# EAGLE design Timelapse_camera_RevC (EAGLE 7.6.0)
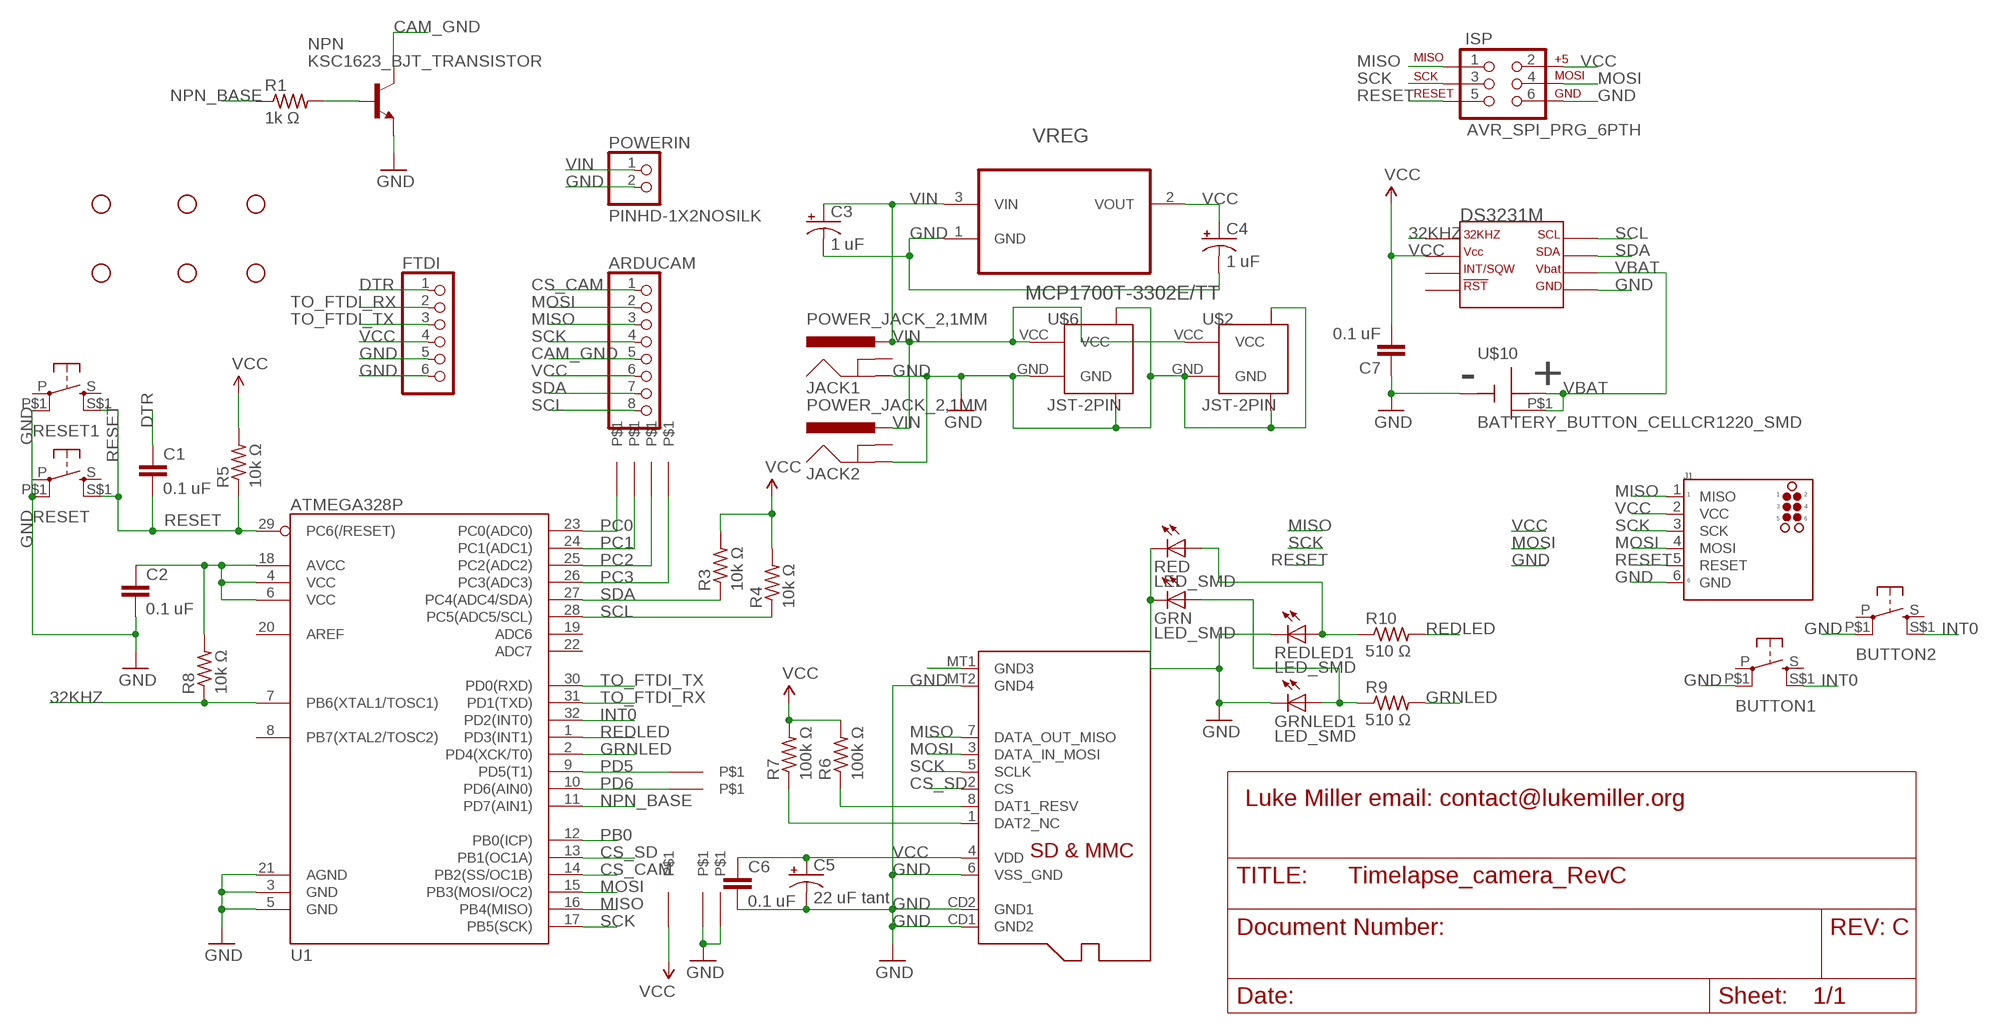
[diagram p0: schematic, sheet 1]

## Parts
ARDUCAM  PINHD-1X8RIGHTANGLE_FEMALE  [1X08-RA]
BUTTON1  PUSHBUTTON_DPST_SMDSTANDARD  [PUSHBUTTON_DPST_SMD]
BUTTON2  PUSHBUTTON_DPST_SMDSTANDARD  [PUSHBUTTON_DPST_SMD]
C1  0.1 uF  CAP0805  [0805]
C2  0.1 uF  CAP0805  [0805]
C3  1 uF  CPOL-USB  [PANASONIC_B]
C4  1 uF  CPOL-USB  [PANASONIC_B]
C5  22 uF tant  CPOL-US0805  [C0805_POL]
C6  0.1 uF  CAP0805  [0805]
C7  0.1 uF  CAP0805  [0805]
DS3231M  DS3231MSOIC-8  [DS3231M_SOIC8]
FTDI  PINHD-1X6CB  [1X06-CLEANBIG]
GRN  LED_SMD  [CHIPLED_0805]
GRNLED1  LED_SMD  [CHIPLED_0805]
ISP  AVR_SPI_PRG_6PTH  [2X3]
J1  TC2030-MCP-NL  [TC2030-MCP-NL]
JACK1  POWER_JACK_2,1MM  [POWER_JACK_DC_2,1MM]
JACK2  POWER_JACK_2,1MM  [POWER_JACK_DC_2,1MM]
NPN  KSC1623_BJT_TRANSISTOR  [SOT23]
POWERIN  PINHD-1X2NOSILK  [1X02_NOSILK]
R1  1k Ω  RESISTOR_SMDR0805  [R0805]
R3  10k Ω  RESISTOR_SMDR0805  [R0805]
R4  10k Ω  RESISTOR_SMDR0805  [R0805]
R5  10k Ω  RESISTOR_SMDR0805  [R0805]
R6  100k Ω  RESISTOR_SMDR0805  [R0805]
R7  100k Ω  RESISTOR_SMDR0805  [R0805]
R8  10k Ω  RESISTOR_SMDR0805  [R0805]
R9  510 Ω  RESISTOR_SMDR0805  [R0805]
R10  510 Ω  RESISTOR_SMDR0805  [R0805]
RED  LED_SMD  [CHIPLED_0805]
REDLED1  LED_SMD  [CHIPLED_0805]
RESET  PUSHBUTTON_DPST_SMDSTANDARD  [PUSHBUTTON_DPST_SMD]
RESET1  PUSHBUTTON_DPST_SMDSTANDARD  [PUSHBUTTON_DPST_SMD]
STANDOFF1  STAND-OFF  [STAND-OFF]
STANDOFF2  STAND-OFF  [STAND-OFF]
STANDOFF3  STAND-OFF  [STAND-OFF]
STANDOFF4  STAND-OFF  [STAND-OFF]
STANDOFF5  STAND-OFF  [STAND-OFF]
STANDOFF6  STAND-OFF  [STAND-OFF]
U1  ATMEGA328P  ATMEGA328_SMT  [TQFP32-08]
U$1  PINHD-1X1STANDARD  [1X01]
U$2  JST-2PIN  [JST-2-SMD-VERT]
U$3  MICROSD  [MICROSD]
U$4  PINHD-1X1STANDARD  [1X01]
U$6  JST-2PIN  [JST-2-SMD-VERT]
U$7  PINHD-1X1STANDARD  [1X01]
U$8  PINHD-1X1STANDARD  [1X01]
U$9  PINHD-1X1STANDARD  [1X01]
U$10  BATTERY_BUTTON_CELLCR1220_SMD  [CR1220_BATTERY_HOLDER_SMD]
U$11  PINHD-1X1STANDARD  [1X01]
U$12  PINHD-1X1STANDARD  [1X01]
U$13  PINHD-1X1STANDARD  [1X01]
U$14  PINHD-1X1STANDARD  [1X01]
VREG  MCP1700T-3302E/TT  [SOT95P237X112-3N]

## Nets
32KHZ: DS3231M.1(P$1_32KHZ) R8.1 U1.7(PB6(XTAL1/TOSC1))
CAM_GND: ARDUCAM.5 NPN.3(C)
CD1: U$3.MT1(GND3)
CS_CAM: ARDUCAM.1 U1.14(PB2(SS/OC1B))
CS_SD: U1.13(PB1(OC1A)) U$3.2(CS)
DTR: C1.1 FTDI.1
GND: BUTTON1.P$1(P1) BUTTON2.P$1(P1) C2.2 C3.- C4.- C5.P$2_C(-) C6.2 C7.1 DS3231M.5(P$5_GND) FTDI.5 FTDI.6 GRN.C GRNLED1.C ISP.6 J1.6(GND) JACK1.P$2(GND) JACK2.P$2(GND) NPN.2(E) POWERIN.2 RED.C REDLED1.C RESET1.P$1(P1) RESET.P$1(P1) U1.3(GND) U1.5(GND) U1.21(AGND) U$2.GND U$2.P$1(BODY1) U$2.P$2(BODY2) U$3.6(VSS_GND) U$3.CD1(GND2) U$3.CD2(GND1) U$3.MT2(GND4) U$6.GND U$6.P$1(BODY1) U$6.P$2(BODY2) U$10.GND U$12.1 U$14.1 VREG.1(GND)
GRNLED: R9.2 U1.2(PD4(XCK/T0))
INT0: BUTTON1.S$1(S1) BUTTON2.S$1(S1) U1.32(PD2(INT0))
MISO: ARDUCAM.3 ISP.1 J1.1(MISO) U1.16(PB4(MISO)) U$3.7(DATA_OUT_MISO)
MOSI: ARDUCAM.2 ISP.4 J1.4(MOSI) U1.15(PB3(MOSI/OC2)) U$3.3(DATA_IN_MOSI)
N$1: NPN.1(B) R1.2
N$2: R7.1 U$3.1(DAT2_NC)
N$3: R6.1 U$3.8(DAT1_RESV)
N$8: GRN.A GRNLED1.A R9.1
N$9: R10.1 RED.A REDLED1.A
NPN_BASE: R1.1 U1.11(PD7(AIN1))
PB0: U1.12(PB0(ICP))
PC0: U1.23(PC0(ADC0)) U$1.1
PC1: U1.24(PC1(ADC1)) U$4.1
PC2: U1.25(PC2(ADC2)) U$7.1
PC3: U1.26(PC3(ADC3)) U$8.1
PD5: U1.9(PD5(T1)) U$9.1
PD6: U1.10(PD6(AIN0)) U$11.1
REDLED: R10.2 U1.1(PD3(INT1))
RESET: C1.2 ISP.5 J1.5(RESET) R5.1 RESET1.S$1(S1) RESET.S$1(S1) U1.29(PC6(/RESET))
SCK: ARDUCAM.4 ISP.3 J1.3(SCK) U1.17(PB5(SCK)) U$3.5(SCLK)
SCL: ARDUCAM.8 DS3231M.8(P$8_SCL) R4.1 U1.28(PC5(ADC5/SCL))
SDA: ARDUCAM.7 DS3231M.7(P$7_SDA) R3.1 U1.27(PC4(ADC4/SDA))
TO_FTDI_RX: FTDI.2 U1.31(PD1(TXD))
TO_FTDI_TX: FTDI.3 U1.30(PD0(RXD))
VBAT: DS3231M.6(P$6_VBAT) U$10.P$1(P$2_VBAT) U$10.P$2(VBAT)
VCC: ARDUCAM.6 C2.1 C4.+ C5.P$1_A(+) C6.1 C7.2 DS3231M.2(P$2_VCC) FTDI.4 ISP.2 J1.2(VCC) R3.2 R4.2 R5.2 R6.2 R7.2 R8.2 U1.4(VCC) U1.6(VCC) U1.18(AVCC) U$3.4(VDD) U$13.1 VREG.2(VOUT)
VIN: C3.+ JACK1.P$1(PWR) JACK2.P$1(PWR) POWERIN.1 U$2.VCC U$6.VCC VREG.3(VIN)
Unconnected: BUTTON1.P BUTTON1.S BUTTON2.P BUTTON2.S DS3231M.3(P$3_INT) DS3231M.4(P$4_RST) JACK1.P$3(GNDBREAK) JACK2.P$3(GNDBREAK) RESET1.P RESET1.S RESET.P RESET.S U1.8(PB7(XTAL2/TOSC2)) U1.19(ADC6) U1.20(AREF) U1.22(ADC7)

## Library data of the parts
ARDUCAM = miller:PINHD-1X8: PIN HEADER
BUTTON1 BUTTON2 RESET RESET1 = miller:PUSHBUTTON_DPST_SMD: PUSHBUTTON DPST SMD Omron B3S-1000 Digikey PN SW836CT-ND This is your standard "hobbyist" style momentary pushbutton in a surface mount package.
C1 C2 C6 C7 = miller:CAP: Capacitor Standard surface mount ceramic capacitor and 0.1" leaded capacitor.
C3-C5 = miller:CPOL-US: POLARIZED CAPACITOR, American symbol
DS3231M = miller:DS3231M: DS3231M real time clock Battery backup, 2.3V to 5.5V supply voltage 1Hz and 32.768kHz outputs NOTE: This is a slightly lower cost version of the regular DS3231S, with fewer clock frequency output options and slightly lower long-term time accuracy. It uses the same I2C communications protocol as the DS3231S, and is available in a small SOIC-8 package or Wide SOIC-16 (0.300") package. Maxim PN DS3231MZ+ SOIC-8 package Maxim PN DS3231M+ SOIC-16 Wide package
FTDI = miller:PINHD-1X6: PIN HEADER
GRN GRNLED1 RED REDLED1 = miller:LED_SMD: LED surface mount 0805
ISP = miller:AVR_SPI_PRG_6: AVR ISP 6 Pin This is the reduced ISP connector for AVR programming. Common on Arduino. This footprint will take up less PCB space and can be used with a 10-pin to 6-pin adapter such as SKU: BOB-08508 **Special note about "TEST_POINT" package. The stop mask is on the top side, so if you want your programming test points to be on the bottom of your board, make sure to place this package on the bottom side of the board. This also ensure that the orientation to program from the bottom side will be correct.
J1 = miller:TC2030: TAG-CONNECT ICSP Connector Manufacturer: Tag-Connect <http://www.tag-connect.com> Cable for easy In-Circuit Serial Programming. Designed for Microchip ICD2, suitable for many others. Two variants - one "with legs" (for hands-free fit on PCB) and another "without legs" for quick programming. Pin labels changed to match AVR ICSP pinout for programming ATMEL AVR chips PAD Description 1 MCLR/Vpp 2 Vdd 3 GND 4 PGD (ISPDAT) 5 PGC (ISPCLK) 6 nc (used for LVP) ©2009 ROFA.cz - modified and updated by Robert Darlington ‹rdarlington@gmail.com›
JACK1 JACK2 = miller:POWER_JACK_2,1MM: DC Power Jack, 2.1mm center pin. Digikey PN CP-202AH-ND
NPN = miller:KSC1623_BJT_TRANSISTOR: KSC1623 BJT NPN transistor - Fairchild Seminconductor KSC1623LMTF Digikey PN KSC1623LMTFCT-ND Mouser PN 512-KSC1623LMTF
POWERIN = miller:PINHD-1X2: 1x2 pin header 0.1" spacing (2.54mm)
R1 R3-R10 = miller:RESISTOR_SMD: RESISTOR, American symbol
STANDOFF1-STANDOFF6 = miller:STAND-OFF: #4 Stand Off This is the mechanical footprint for a #4 phillips button head screw. Use the keepout ring to avoid running the screw head into surrounding components. SKU : PRT-00447
U1 = miller:ATMEGA328_SMT: 32-Pin Atmega328
U$1 U$4 U$7-U$9 U$11-U$14 = miller:PINHD-1X1: Just a single pin header, useful for making test point or stand-alone header hole for normal 0.1" pitch through-hole header pins The SMALL footprint is 0.035" diameter, barely large enough for standard 0.1" pitch header pins. The SMALL_0.7 footprint is 1.056mm diameter, drill hole is 0.7mm, too small for 0.1" pitch header pins
U$2 U$6 = miller:JST-2PIN: JST B2B-PH-SM4-TM 2-pin connector 2.0 mm spacing surface mount, vertical entry Accepts JST PHR-2 female connectors
U$3 = miller:MICROSD: Micro-SD / Transflash card holder with SPI pinout For the 3M # 2908-05WB-MG and/or 4UCON #19656 push-push type (spring-loaded) Digikey PN 3M5607CT-ND
U$10 = miller:BATTERY_BUTTON_CELL: Coin cell battery holders Check that you choose the appropriate battery size CR1025 (10 mm) CR1220 (12 mm)
VREG = Microchip_By_element14_Batch_1:MCP1700T-3302E/TT: Low Quiescent Current LDO; MPN: MCP1700T-3302E/TT; OC_FARNELL: 1296592; OC_NEWARK: 88H9817; PACKAGE: SOT23-3; SUPPLIER: Microchip

## Board
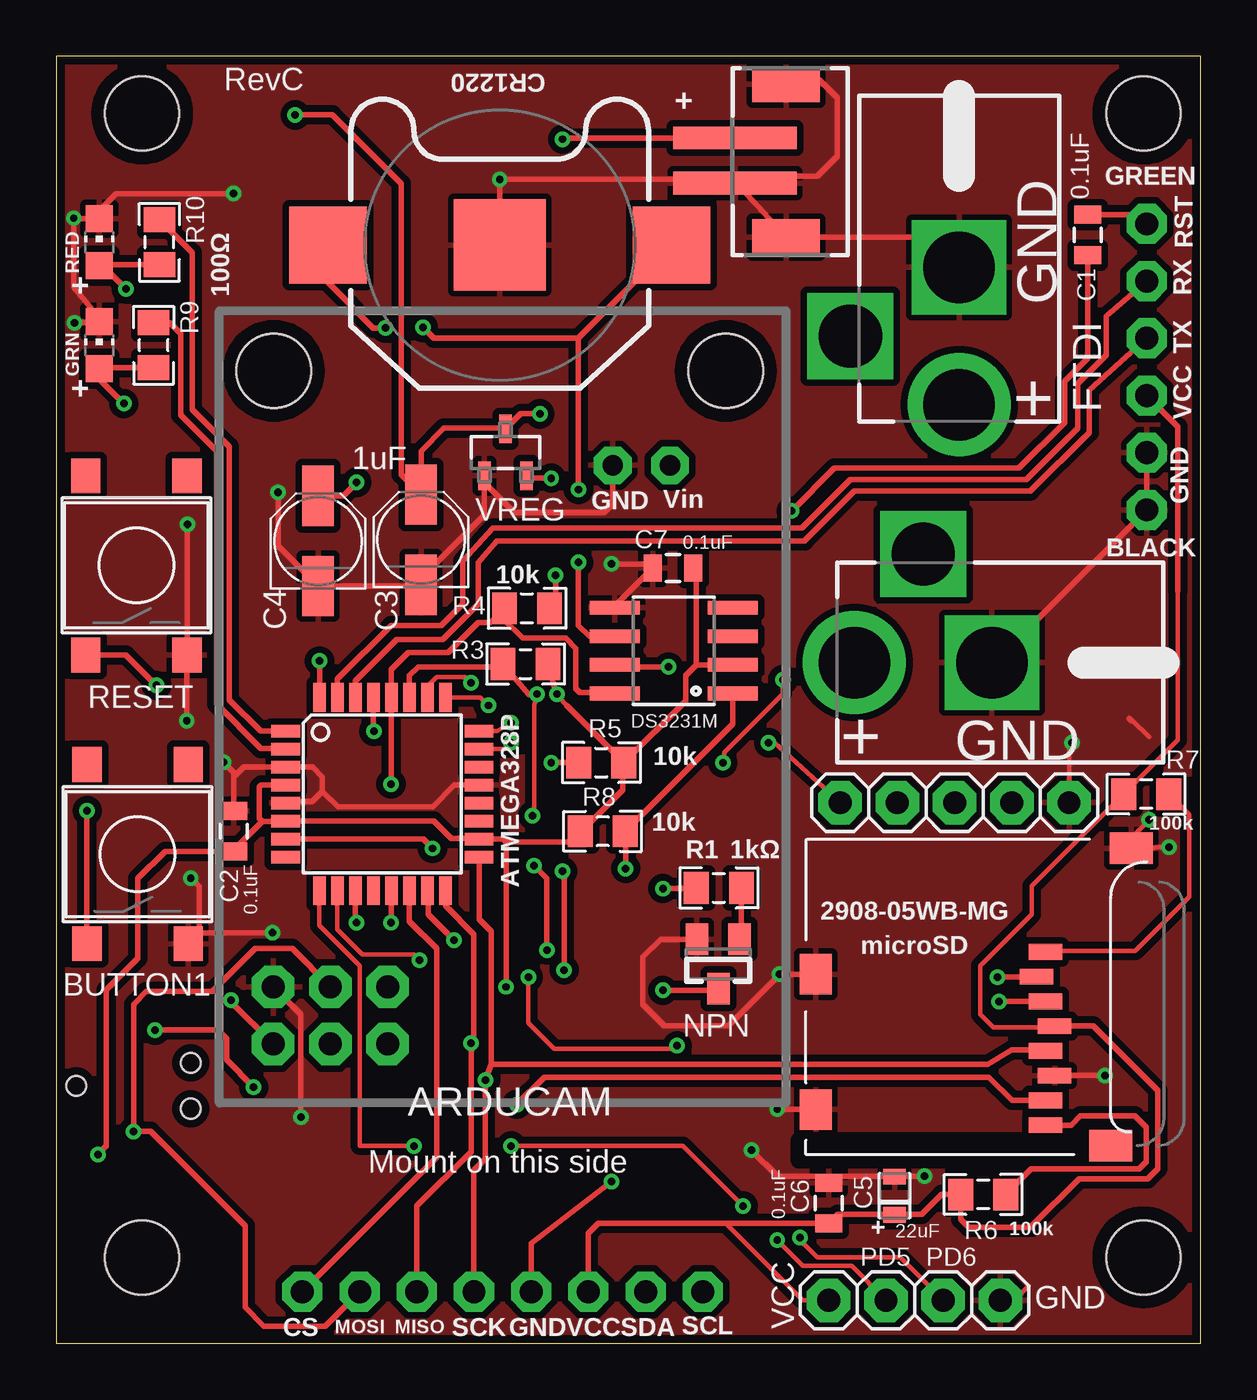
[diagram p1: board, top side]
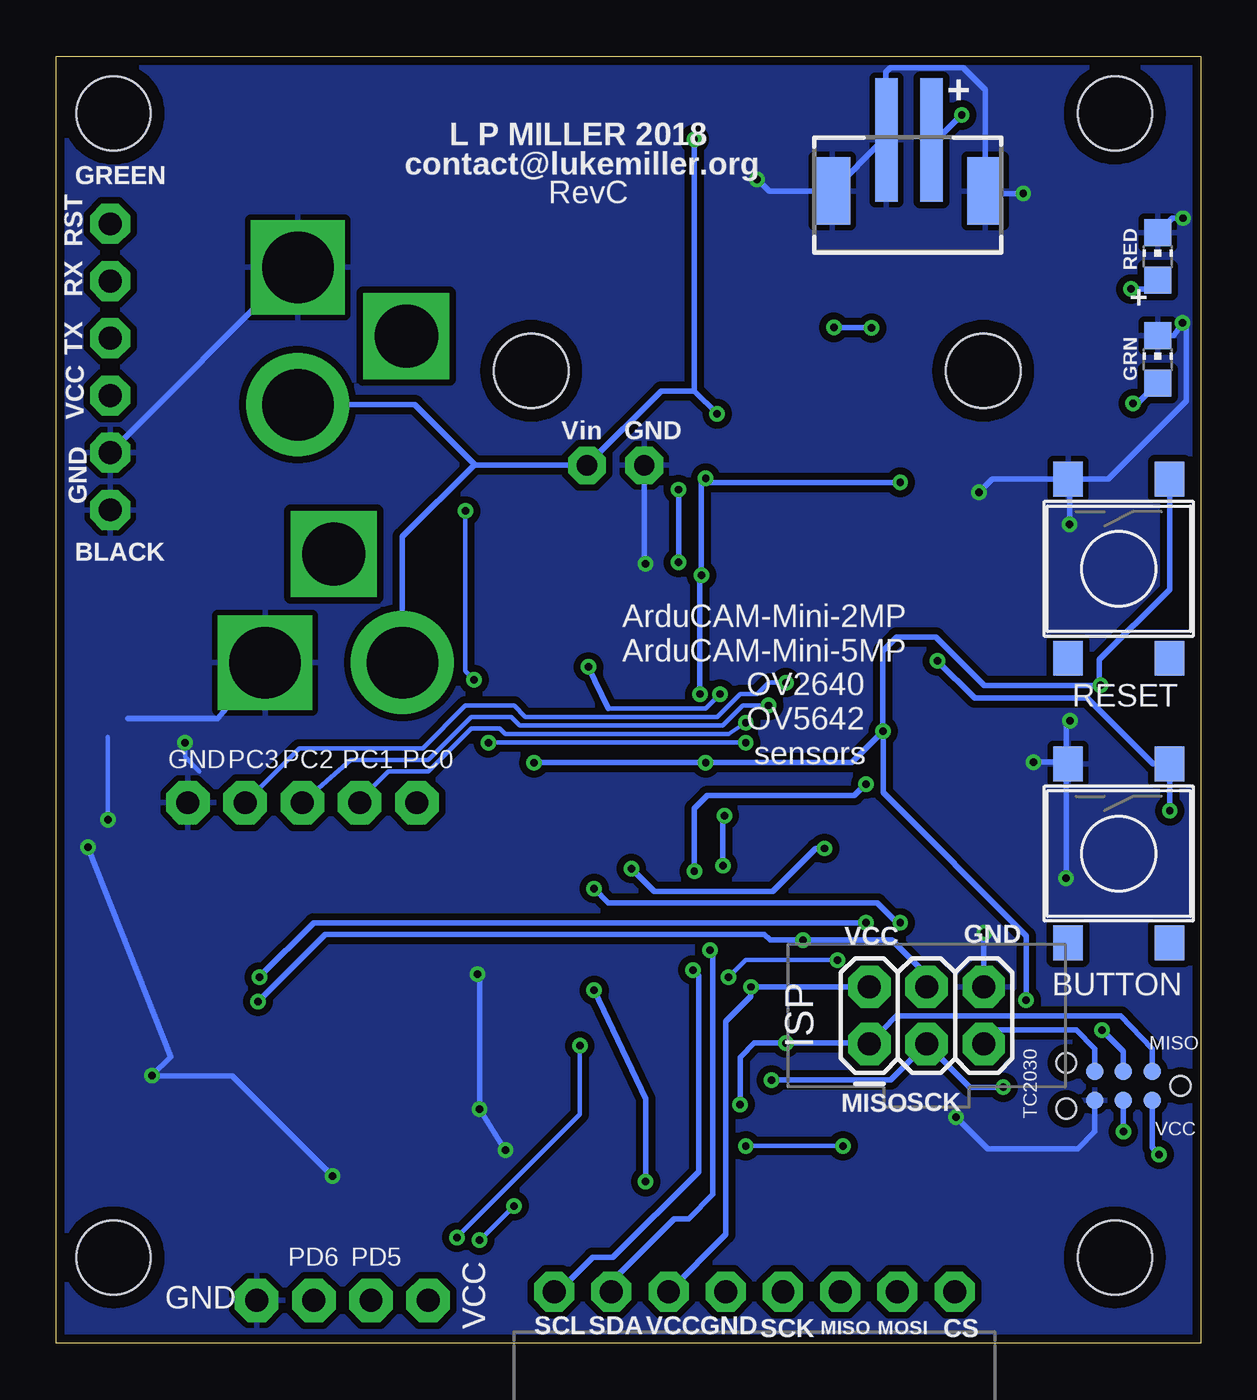
[diagram p2: board, bottom side, seen from below]

Size 50.8 x 57.15 mm. Coordinates in mm from the lower left corner, seen from the top.
Outline: 0,0 50.8,0 50.8,57.15 0,57.15 0,0
Copper layers (1*16): Top 0.0356mm / dielectric 1.5011mm / Bottom 0.0356mm
Design rules "LaenPCBOrder *": minimum track width 6mil, minimum drill 13mil, track to track 6mil, track to pad 6mil, pad to pad 6mil, via to via 6mil, smd to smd 6mil, copper to edge 15mil, drill to drill 6mil, minimum pad ring 7mil, minimum via ring 7mil, stop-mask expansion 3mil, vias tented up to drill 30mil, thermal gap 10mil

### Footprints (pad centres in the part's own frame; a part is rotated, then mirrored left to right if it is on the bottom)
1X08-RA = drill 1.016 pad 1.778 octagon: 1 0,0; 2 2.54,0; 3 5.08,0; 4 7.62,0; 5 10.16,0; 6 12.7,0; 7 15.24,0; 8 17.78,0
PUSHBUTTON_DPST_SMD = smd 1.55 x 1.3: P 3.975,-2.25; P$1 -3.975,-2.25; S 3.975,2.25; S$1 -3.975,2.25
0805 = smd 0.8 x 1.2: 1 -0.9,0; 2 0.9,0
PANASONIC_B = smd 2.667 x 1.4: + 2.006,0; - -2.006,0
C0805_POL = smd 0.7 x 1: P$1_A -0.85,0; P$2_C 0.85,0
DS3231M_SOIC8 = smd 0.61 x 2.21: 1 -1.905,-2.616; 2 -0.635,-2.616; 3 0.635,-2.616; 4 1.905,-2.616; 5 1.905,2.616; 6 0.635,2.616; 7 -0.635,2.616; 8 -1.905,2.616
1X06-CLEANBIG = drill 1.016 pad 1.778 octagon: 1 -6.35,0; 2 -3.81,0; 3 -1.27,0; 4 1.27,0; 5 3.81,0; 6 6.35,0
CHIPLED_0805 = smd 1.2 x 1.2: A 0,-1.05; C 0,1.05
2X3 = drill 1.016 pad 1.88 octagon: 1 -2.54,0; 2 -2.54,2.54; 3 0,0; 4 0,2.54; 5 2.54,0; 6 2.54,2.54
TC2030-MCP-NL = smd 0.787 x 0.787: 1 1.27,-0.635; 2 1.27,0.635; 3 2.54,-0.635; 4 2.54,0.635; 5 3.81,-0.635; 6 3.81,0.635 | hole 0.889: 0,0; 5.08,-1.016; 5.08,1.016
POWER_JACK_DC_2,1MM = drill 3.175 pad 4.572: P$1 0,0 | drill 3.175 square: P$2 6.096,0 | drill 2.8 square: P$3 3.048,4.826
SOT23 = smd 1 x 1.4: 1 -0.95,-1.1; 2 0.95,-1.1; 3 0,1.1
1X02_NOSILK = drill 0.9 pad 1.676 octagon: 1 -1.27,0; 2 1.27,0
R0805 = smd 1.1 x 1.4: 1 -1,0; 2 1,0
STAND-OFF = hole 3.302: 0,0
TQFP32-08 = smd 1.27 x 0.559: 1 -4.293,2.8; 2 -4.293,2; 3 -4.293,1.2; 4 -4.293,0.4; 5 -4.293,-0.4; 6 -4.293,-1.2; 7 -4.293,-2; 8 -4.293,-2.8; 17 4.293,-2.8; 18 4.293,-2; 19 4.293,-1.2; 20 4.293,-0.4; 21 4.293,0.4; 22 4.293,1.2; 23 4.293,2; 24 4.293,2.8 | smd 0.559 x 1.27: 9 -2.8,-4.293; 10 -2,-4.293; 11 -1.2,-4.293; 12 -0.4,-4.293; 13 0.4,-4.293; 14 1.2,-4.293; 15 2,-4.293; 16 2.8,-4.293; 25 2.8,4.293; 26 2,4.293; 27 1.2,4.293; 28 0.4,4.293; 29 -0.4,4.293; 30 -1.2,4.293; 31 -2,4.293; 32 -2.8,4.293
1X01 = drill 1.016 pad 1.93 octagon: 1 0,0
JST-2-SMD-VERT = smd 1 x 5.5: GND 1,-2; VCC -1,-2 | smd 1.6 x 3: P$1 -3.4,0.27; P$2 3.4,0.27
MICROSD = smd 0.7 x 1.5: 1 9,-10.64; 2 7.9,-10.24; 3 6.8,-10.64; 4 5.7,-11.04; 5 4.6,-10.64; 6 3.5,-11.04; 7 2.4,-10.64; 8 1.3,-10.64 | smd 1.8 x 1.4: CD1 2,-0.44; CD2 8,-0.44 | smd 1.4 x 1.9: MT1 0.4,-13.54; MT2 13.6,-14.44
CR1220_BATTERY_HOLDER_SMD = smd 4.064 x 4.064: GND 0,0 | smd 3.429 x 3.429: P$1 -7.62,0; P$2 7.62,0
SOT95P237X112-3N = smd 0.559 x 1.27: 1 -0.94,-1.041; 2 0.94,-1.041; 3 0,1.041

### Placement (x,y rotation side)
ARDUCAM  10.92,2.29 180 bottom
BUTTON1  3.61,21.72 90 top
BUTTON2  3.63,21.74 270 bottom
C1  45.78,49.21 270 top
C2  7.87,22.73 90 top
C3  16.19,35.69 90 top
C4  11.62,35.62 90 top
C5  37.21,6.55 90 top
C6  34.29,6.22 90 top
C7  27.37,34.42 0 top
DS3231M  27.41,30.76 90 top
FTDI  48.41,43.36 270 top
GRN  1.91,44.32 0 top
GRNLED1  1.91,43.69 0 bottom
ISP  12.17,13.28 0 bottom
J1  0.89,11.43 180 bottom
JACK1  40.08,41.68 90 top
JACK2  35.43,30.23 0 top
NPN  29.39,16.84 180 top
POWERIN  25.97,38.99 180 top
R1  29.41,20.22 0 top
R3  20.83,30.16 0 top
R4  20.89,32.64 0 top
R5  24.19,25.78 0 top
R6  41.15,6.6 180 top
R7  48.39,24.38 180 top
R8  24.26,22.73 180 top
R9  4.32,44.32 90 top
R10  4.57,48.9 90 top
RED  1.91,48.9 0 top
REDLED1  1.91,48.26 0 bottom
RESET  3.56,34.54 90 top
RESET1  3.63,34.39 270 bottom
STANDOFF1  48.26,3.81 0 top
STANDOFF2  48.26,54.61 0 top
STANDOFF3  3.81,3.81 0 top
STANDOFF4  3.81,54.61 0 top
STANDOFF5  9.65,43.18 0 top
STANDOFF6  29.72,43.18 0 top
U1  14.48,24.38 0 top
U$1  34.8,24 0 top
U$2  12.95,51.44 180 bottom
U$3  33.27,8.38 90 top
U$4  37.34,24 0 top
U$6  32.13,52.51 270 top
U$7  39.88,24 0 top
U$8  42.42,24 0 top
U$9  36.83,1.91 0 top
U$10  19.68,48.77 0 top
U$11  39.37,1.91 0 top
U$12  41.91,1.91 0 top
U$13  34.29,1.91 0 top
U$14  44.96,24 0 top
VREG  19.94,39.56 0 top

### Tracks (layer width: path | path; a pad name or v marks a point on that pad's centre or on a via)
32KHZ  (via drill 0.33)
  Top 0.254: DS3231M.1 30.02,27.5 R8.1 25.27,22.72 v25.27,21.08 | U1.7 16.29,22.38 v16.7,21.97
  Bottom 0.254: v16.7,21.97 17.08,21.97 18.99,20.07 24.26,20.07 v25.27,21.08
CAM_GND  (via drill 0.33)
  Top 0.254: ARDUCAM.5 21.08,4.45 v24.64,7.18 | v26.92,15.67 29.32,15.67 NPN.3
  Bottom 0.254: v24.64,7.18 24.64,10.85 v26.92,15.67
CS_CAM
  Top 0.254: U1.14 15.68,18.74 16.89,17.53 16.89,8.26 ARDUCAM.1
CS_SD  (via drill 0.33)
  Top 0.254: U1.13 14.88,18.69 v14.86,18.67 | v41.78,16.26 43.49,16.26 U$3.2
  Bottom 0.254: v14.86,18.67 39.37,18.67 v41.78,16.26
DTR
  Top 0.254: C1.1 48.01,50.11 FTDI.1
GND  (via drill 0.33)
  Top 0.203: U$3.MT2 47.71,22.44 v48.51,23.24 | 48.51,26.92 47.75,27.69 | U$12.1 42.55,1.91 43.18,2.54 | U$14.1 44.96,26.54 v45.09,26.67
  Top 0.254: v9.59,18.22 6.34,18.22 | 6.34,18.22 BUTTON1.P$1 | v46.56,11.89 U$3.6 | 34.57,7.4 C5.P$2_C 38.52,7.4 v38.54,7.43 | 34.57,7.4 C6.2 | U$3.CD1 32.01,10.38 v32,10.39 | U$3.CD2 v32.11,16.38 29.82,14.1 26.99,14.1 26.04,15.05 26.04,17.14 26.83,17.94 NPN.2 | 34.57,7.4 32.03,7.4 v30.86,8.57 | DS3231M.5 24.79,32.74 C7.1 26.28,34.61 v24.64,34.61 | 11.81,24.51 11.81,25.15 11.37,25.58 U1.3 8.32,25.59 7.87,25.15 | 11.81,24.51 11.37,24.07 10.27,24.07 U1.5 | FTDI.5 FTDI.6 41.53,30.12 JACK2.P$2 | 47.71,27.66 47.62,27.75 | U$3.MT2 47.55,21.98 v49.4,22.04 | v10.86,10.03 10.86,14.59 ISP.6 | U1.21 17.67,24.78 16.7,23.81 12.51,23.81 11.81,24.51 | C2.2 7.87,25.15 | 7.87,25.15 7.87,25.35 v7.42,25.81 | 6.34,18.22 6.34,20.28 v5.97,20.65 | v0.8,45.31 1.85,45.31 GRN.C 1.91,45.52 0.78,46.9 v0.78,49.96 0.98,49.95 RED.C 1.91,50.29 2.67,51.05 v7.87,51.05 | U$10.GND v19.68,51.69 30.11,51.69 U$6.GND | v9.84,37.78 9.84,35.4 C4.- 16.13,33.62 C3.- 16.19,33.97 18.99,36.77 18.99,38.51 VREG.1 19,38.21 20.32,36.89 24.32,36.89 24.7,37.27 POWERIN.2 | v5.79,27.64 5.79,30.55 RESET.P$1 5.81,36.36 v5.82,36.37 | U$6.P$1 33.87,56.1 34.67,55.31 34.67,52.7 33.78,51.82 30.24,51.82 U$6.GND | U$6.GND 30.13,51.58 U$6.P$2 38.94,49.11 JACK1.P$2
  Bottom 0.203: v45.09,26.67 45.09,26.04 44.45,25.4 | v48.51,23.24 48.51,26.92
  Bottom 0.254: ISP.6 9.63,18.19 v9.59,18.22 | v32.11,16.38 32,16.28 v32,10.39 v30.86,8.57 | 47.62,27.75 43.62,27.75 JACK2.P$2 | v49.4,22.04 45.72,12.72 v46.56,11.89 46.55,11.87 42.99,11.87 v38.54,7.43 | J1.6 4.7,9.4 5.46,8.64 9.46,8.64 v10.86,10.03 | v7.42,25.81 5.97,25.81 | 5.97,25.81 BUTTON2.P$1 5.97,25.63 v5.97,20.65 | GRNLED1.C 1.19,44.74 v0.8,45.31 0.64,45.29 0.64,41.83 4.1,38.37 RESET1.P$1 | v0.78,49.96 1.25,49.96 REDLED1.C | v7.87,51.05 9.44,51.05 U$2.P$1 9.55,55.66 10.54,56.64 13.78,56.64 13.97,56.45 13.97,53.45 U$2.GND 14.08,53.44 U$2.P$2 19.16,51.16 v19.68,51.69 | RESET1.P$1 9.26,38.37 v9.84,37.78 | 5.97,25.81 5.97,27.45 v5.79,27.64 | v5.82,36.37 5.82,38.3 RESET1.P$1 | JACK1.P$2 40.18,47.78 FTDI.5 | POWERIN.2 24.7,34.67 v24.64,34.61
  pour Top (isolate 0.305): 0,-0.05 50.8,-0.05 50.8,57.15 0,57.15
  pour Bottom (isolate 0.305): 0,0 50.8,0 50.8,57.15 0,57.15
GRNLED
  Top 0.254: R9.2 5.03,45.32 5.52,44.83 5.52,41.21 7.11,39.62 7.11,28.38 9.08,26.42 10.15,26.42 U1.2
INT0  (via drill 0.33)
  Top 0.254: BUTTON1.S$1 1.36,23.63 v1.37,23.65 | v11.68,30.3 U1.32
  Bottom 0.254: v1.37,23.65 1.37,25.71 BUTTON2.S$1 2.1,25.72 5.03,28.65 10.03,28.65 v11.68,30.3
MISO  (via drill 0.33)
  Top 0.254: U1.16 17.28,19.43 18.54,18.16 18.54,13.46 v18.41,13.34 18.41,8.51 16,6.1 ARDUCAM.3 | U$3.7 42.43,10.78 41.4,11.81 21.65,11.81 v20.45,10.6
  Bottom 0.254: J1.1 2.16,13.08 3.56,14.54 13.51,14.54 ISP.1 14.76,13.34 v18.41,13.34 19.81,13.34 20.45,12.7 v20.45,10.6
MOSI  (via drill 0.33)
  Top 0.254: v17.65,17.91 16.51,19.05 16.51,20.06 U1.15 | ISP.4 10.46,17.53 8.83,17.53 6.92,15.62 4,15.62 3.43,15.05 v3.43,9.4 4.19,9.4 8.38,5.21 8.38,1.59 9.21,0.76 11.94,0.76 ARDUCAM.2 | v41.85,15.18 U$3.3
  Bottom 0.254: ISP.4 12.17,16.36 13.72,17.91 v17.65,17.91 19.11,17.91 19.37,18.16 38.86,18.16 v41.85,15.18 | J1.4 v3.43,9.4
N$1
  Top 0.254: R1.2 30.41,18.02 NPN.1
N$2
  Top 0.203: 43.88,17.42 47.9,17.42 50.29,19.81 50.29,23.48 R7.1
  Top 0.254: 43.88,17.42 U$3.1
N$3
  Top 0.254: U$3.8 45.05,9.68 45.47,10.1 47.88,10.1 48.39,9.59 48.39,8.06 48.07,7.75 43.29,7.75 R6.1
N$8  (via drill 0.33)
  Top 0.254: R9.1 1.96,43.32 GRN.A 1.91,42.82 v3,41.73
  Bottom 0.254: v3,41.73 2.81,41.73 GRNLED1.A
N$9  (via drill 0.33)
  Top 0.254: R10.1 1.96,47.9 RED.A 2.07,47.84 v3.1,46.81
  Bottom 0.254: v3.1,46.81 2.3,46.81 REDLED1.A
NPN_BASE  (via drill 0.33)
  Top 0.254: U1.11 13.28,18.73 v13.34,18.67 | v26.92,20.19 28.39,20.19 R1.1
  Bottom 0.254: v13.34,18.67 13.46,18.67 14.35,19.56 26.29,19.56 v26.92,20.19
PC0  (via drill 0.33)
  Top 0.203: U1.23 19.91,26.38 v20.19,26.67 | v31.62,26.67 31.88,26.67 U$1.1
  Bottom 0.203: v20.19,26.67 v31.62,26.67
PC1  (via drill 0.33)
  Top 0.203: U1.24 19.56,27.18 v20.19,27.56
  Bottom 0.203: v20.19,27.56 20.95,27.05 30.86,27.05 31.11,27.3 32.38,27.3 34.29,25.4 36.07,25.4 37.34,24.13 U$4.1
PC2  (via drill 0.33)
  Top 0.203: U1.25 18.82,28.68 v19.18,28.32
  Bottom 0.203: v19.18,28.32 20.32,28.32 21.21,27.43 30.23,27.43 30.61,27.81 32.38,27.81 34.29,25.91 37.72,25.91 U$7.1
PC3  (via drill 0.33)
  Top 0.203: U1.26 16.48,29.18 16.89,29.59 18.16,29.59 v18.41,29.34
  Bottom 0.203: v18.41,29.34 19.18,29.34 19.68,28.83 20.45,28.83 21.46,27.81 29.97,27.81 30.48,28.32 32.64,28.32 34.54,26.42 40.01,26.42 U$8.1
PD5  (via drill 0.33)
  Top 0.203: U1.9 11.68,18.55 13.46,16.76 13.46,8.76 v15.88,8.76 | v20.19,8.76 27.81,8.76 v30.48,6.1 | v32,4.57 33.15,3.43 35.31,3.43 U$9.1
  Bottom 0.203: v15.88,8.76 v20.19,8.76 | v30.48,6.1 v32,4.57
PD6  (via drill 0.33)
  Top 0.203: U1.10 12.48,18.38 13.59,17.27 15.88,17.27 v16.13,17.02 | v20.95,16.26 20.95,14.22 22.1,13.08 27.43,13.08 v27.56,13.21 | U$11.1 37.47,3.81 33.78,3.81 33.02,4.57 v33.02,4.7
  Bottom 0.203: v16.13,17.02 20.19,17.02 v20.95,16.26 | v27.56,13.21 27.56,10.16 v33.02,4.7
REDLED
  Top 0.254: U1.1 9.07,27.18 7.68,28.57 7.68,39.81 6.03,41.47 6.03,48.43 R10.2
RESET  (via drill 0.33)
  Top 0.203: v29.59,25.78 29.59,25.97 29.65,25.97 29.65,26.23 32.26,28.83 v32.26,29.46
  Top 0.254: U1.29 14.08,27.2 v14.1,27.18 | v7.75,15.24 7.75,15.16 ISP.5 | R5.1 v21.97,25.78 | C1.2 45.78,43.75 44.77,42.74 44.77,40.89 42.74,38.86 34.54,38.86 v32.64,36.96 | RESET.S$1 3.09,30.57 v4.45,29.21
  Bottom 0.203: 29.4,25.78 v29.59,25.78 | v32.64,36.96 32.64,29.84 v32.26,29.46
  Bottom 0.254: J1.5 4.7,13.08 5.52,13.91 9,13.91 ISP.5 | v14.1,27.18 14.1,24.45 7.75,18.1 v7.75,15.24 | v14.1,27.18 15.49,25.78 v21.97,25.78 29.4,25.78 | v14.1,27.18 14.12,27.2 14.12,30.73 13.49,31.37 11.76,31.37 9.6,29.21 v4.45,29.21 4.5,29.26 4.5,30.35 1.38,33.47 RESET1.S$1
SCK  (via drill 0.33)
  Top 0.254: U1.17 18.77,18.82 19.3,18.29 19.3,12.38 | 19.3,12.38 v19.05,11.68 19.05,8.19 18.54,7.68 ARDUCAM.4 | v4.38,13.91 7.18,13.91 7.56,13.53 7.56,12.57 v8.76,11.37 | 19.3,12.38 41.34,12.38 42.42,13.02 43.95,13.02 | 44.51,13.02 43.95,13.02 | 43.95,13.02 U$3.5
  Bottom 0.254: v19.05,11.68 13.77,11.68 ISP.3 10.25,11.37 v8.76,11.37 | J1.3 3.43,12.95 v4.38,13.91
SCL  (via drill 0.33)
  Top 0.254: DS3231M.8 24.75,28.89 23.24,28.89 23.05,29.08 23.05,30.86 22.61,31.3 20.7,31.3 19.89,32.12 R4.1 19.26,32 18.73,32 17.4,30.67 15.62,30.67 14.88,29.93 U1.28 14.86,28.66 v14.86,24.83 | v22.54,16.57 22.54,20.89 v22.48,20.95
  Bottom 0.254: ARDUCAM.8 28.51,2.29 26.99,3.81 26.1,3.81 22.29,7.62 22.29,16.32 v22.54,16.57 | v22.48,20.95 22.48,23.75 21.91,24.32 15.37,24.32 v14.86,24.83
SDA  (via drill 0.33)
  Top 0.203: v21.14,23.43 21.21,23.5 21.21,28.32 v21.34,28.83
  Top 0.254: U1.27 15.68,29.65 16.07,30.04 19.57,30.04 R3.1 20.97,28.81 v21.34,28.83 | v27.18,30.04 24.88,30.04 DS3231M.7 | v21.78,17.46 21.78,20.64 v21.21,21.21
  Bottom 0.203: 26.29,28.19 21.97,28.19 v21.34,28.83
  Bottom 0.254: 26.29,28.19 v27.18,30.04 | ARDUCAM.7 26.16,2.73 23.37,5.52 22.73,5.52 21.65,6.6 21.65,17.34 v21.78,17.46 | v21.21,21.21 21.21,23.37 v21.14,23.43
TO_FTDI_RX
  Top 0.254: U1.31 12.48,29.5 14.86,31.88 17.08,31.88 18.03,32.83 18.03,34.73 19.37,36.2 33.08,36.2 35.24,38.35 43.05,38.35 45.34,40.64 45.34,42.61 46.61,43.88 46.61,45.62 FTDI.2
TO_FTDI_TX
  Top 0.254: U1.30 13.28,29.41 15.11,31.24 17.14,31.24 18.73,32.83 18.73,34.67 19.56,35.62 33.21,35.62 35.43,37.85 43.24,37.85 45.85,40.45 45.85,42.32 FTDI.3
VBAT  (via drill 0.33)
  Top 0.254: DS3231M.6 23.66,31.39 23.18,31.88 v23.18,34.67 | v23.18,37.91 23.18,44.64 | 23.18,44.64 U$10.P$2 | U$10.P$1 12.06,47.09 14.07,45.09 v14.61,45.09 | 23.18,44.64 16.75,44.64 v16.28,45.11
  Bottom 0.254: v23.18,34.67 v23.18,37.91 | v16.28,45.11 14.63,45.11 v14.61,45.09
VCC  (via drill 0.33)
  Top 0.203: v22.23,28.83 22.53,28.45 22.65,28.32 | 44.27,14.03 41.59,14.03 41.02,14.61 41.02,16.76 43.31,19.05 43.31,20.3 R7.2 49.78,26.78 49.78,33.4 | U$13.1 33.15,1.91 29.72,5.33
  Top 0.254: 19.96,22.25 19.83,22.38 U1.18 18.74,22.42 17.53,22.42 16.76,23.18 U1.6 9.14,23.18 | 19.96,22.25 v19.96,15.82 | 37.22,5.71 38.42,5.71 39.31,6.6 R6.2 40.15,5.51 40.51,5.14 43.31,5.14 43.31,5.21 45.4,7.3 48.45,7.3 48.9,7.75 48.9,11.24 46.04,14.1 44.33,14.1 U$3.4 44.27,14.03 | 37.22,5.71 C5.P$1_A | 37.22,5.71 34.68,5.71 C6.1 34.28,5.33 29.72,5.33 24.07,5.33 23.62,4.89 ARDUCAM.6 | R3.2 22.21,28.72 v22.23,28.83 | v22.16,34.1 22.16,32.91 R4.2 | DS3231M.2 28.41,30.12 | 28.41,30.12 27.94,29.65 27.94,28.53 R5.2 | 28.41,30.12 28.41,34.28 C7.2 | 19.96,22.25 22.77,22.25 R8.2 23.3,22.73 25.15,24.57 25.15,25.73 R5.2 | 22.65,28.32 R5.2 | U1.4 9.1,24.78 9.02,24.7 9.02,23.3 9.14,23.18 | 49.78,33.4 49.78,40.72 FTDI.4 | v1.84,8.38 2.22,8.76 2.22,15.68 3.62,17.08 3.62,20.64 4.83,21.84 7.86,21.84 C2.1 7.87,21.91 9.14,23.18 | v21.97,38.42 20.98,38.42 VREG.2 | C4.+ 12.74,37.63 v13.34,38.23
  Bottom 0.254: ISP.2 v19.96,15.82 19.96,15.4 21.08,14.29 21.08,4.83 ARDUCAM.6 | v22.23,28.83 22.23,34.04 v22.16,34.1 22.16,38.23 v21.97,38.42 21.78,38.23 v13.34,38.23 | J1.2 2.16,8.7 v1.84,8.38
VIN  (via drill 0.33)
  Top 0.254: v10.6,54.55 12.26,54.55 15.3,51.5 15.3,38.58 C3.+ 16.19,39.62 17.21,40.64 19.9,40.64 VREG.3 20.61,41.27 v21.46,41.27 | U$6.VCC 22.53,53.51 v22.48,53.47
  Bottom 0.254: U$2.VCC 11.72,53.44 v10.6,54.55 | v22.48,53.47 22.48,42.29 | 22.48,42.29 v21.46,41.27 | JACK1.P$1 34.89,41.68 32.23,39.02 | 32.23,39.02 32.19,38.99 POWERIN.1 23.94,42.29 22.48,42.29 | JACK2.P$1 35.43,35.81 32.23,39.02

### Text on the board
tPlace: RevC | CR1220 | + | 0.1uF | GREEN | RST | RX | + | 100Ω | TX | + | VCC | 1uF | GND | Vin | GND | 0.1uF | 10k | BLACK | ATMEGA328P | 10k | 10k | 100k | 1kΩ | 0.1uF | 2908-05WB-MG | microSD | Mount on this side | 0.1uF | 22uF | 100k | PD5 | PD6 | GND | VCC | CS | MOSI | MISO | SCK | GND | VCC | SDA | SCL
bPlace: + | L P MILLER 2018 | contact@lukemiller.org | RevC | GREEN | RED | RST | + | RX | GRN | TX | VCC | GND | Vin | GND | BLACK | ArduCAM-Mini-2MP / ArduCAM-Mini-5MP | OV2640 / OV5642 / sensors | RESET | PC0 | PC1 | PC2 | PC3 | GND | GND | VCC | BUTTON | MISO | TC2030 | SCK | MISO | VCC | PD5 | PD6 | GND | VCC | VCC | CS | MOSI | MISO | SCK | GND | VCC | SDA | SCL